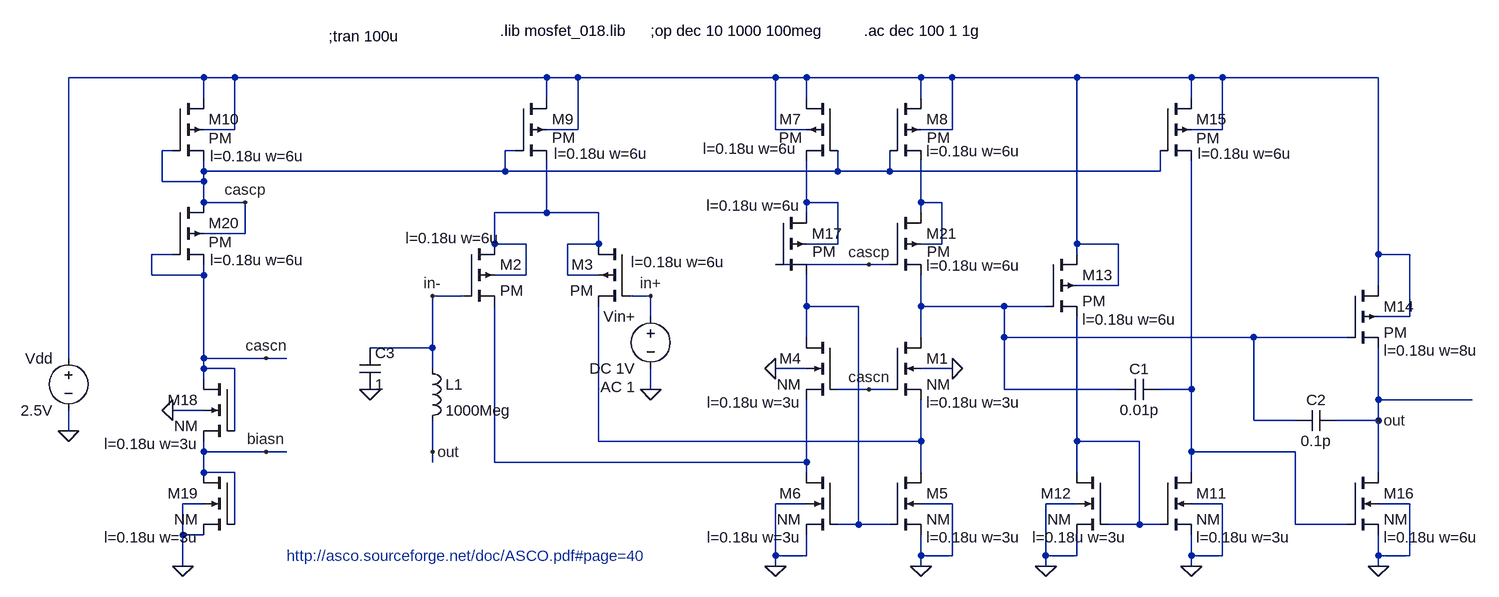
[diagram p0: schematic opamp.asc]
opamp.asc, the LTspice schematic file:
Version 4
SHEET 1 1160 760
WIRE -848 -112 -1056 -112
WIRE -800 -112 -848 -112
WIRE -320 -112 -800 -112
WIRE -272 -112 -320 -112
WIRE 32 -112 -272 -112
WIRE 80 -112 32 -112
WIRE 256 -112 80 -112
WIRE 304 -112 256 -112
WIRE 496 -112 304 -112
WIRE 672 -112 496 -112
WIRE 720 -112 672 -112
WIRE 960 -112 720 -112
WIRE -848 -80 -848 -112
WIRE -320 -80 -320 -112
WIRE 80 -80 80 -112
WIRE 256 -80 256 -112
WIRE 672 -80 672 -112
WIRE -800 -32 -800 -112
WIRE -800 -32 -848 -32
WIRE -272 -32 -272 -112
WIRE -272 -32 -320 -32
WIRE 32 -32 32 -112
WIRE 80 -32 32 -32
WIRE 304 -32 304 -112
WIRE 304 -32 256 -32
WIRE 720 -32 720 -112
WIRE 720 -32 672 -32
WIRE -896 0 -912 0
WIRE -368 0 -384 0
WIRE -848 32 -848 16
WIRE -384 32 -384 0
WIRE -384 32 -848 32
WIRE 128 32 128 0
WIRE 128 32 -384 32
WIRE 208 32 208 0
WIRE 208 32 128 32
WIRE 624 32 624 0
WIRE 624 32 208 32
WIRE -912 48 -912 0
WIRE -848 48 -848 32
WIRE -848 48 -912 48
WIRE -848 80 -848 48
WIRE -784 80 -848 80
WIRE 80 80 80 16
WIRE 128 80 80 80
WIRE 256 80 256 16
WIRE 288 80 256 80
WIRE -320 96 -320 16
WIRE -320 96 -400 96
WIRE -240 96 -320 96
WIRE 80 96 80 80
WIRE 256 96 256 80
WIRE -784 128 -784 80
WIRE -784 128 -848 128
WIRE -400 144 -400 96
WIRE -352 144 -400 144
WIRE -240 144 -240 96
WIRE -240 144 -288 144
WIRE 128 144 128 80
WIRE 128 144 80 144
WIRE 288 144 288 80
WIRE 288 144 256 144
WIRE 496 144 496 -112
WIRE 560 144 496 144
WIRE -896 160 -928 160
WIRE 496 160 496 144
WIRE 960 160 960 -112
WIRE 1008 160 960 160
WIRE 176 176 32 176
WIRE 208 176 176 176
WIRE -928 192 -928 160
WIRE -848 192 -848 176
WIRE -848 192 -928 192
WIRE -352 192 -352 144
WIRE -352 192 -400 192
WIRE -288 192 -288 144
WIRE -240 192 -288 192
WIRE 560 208 560 144
WIRE 560 208 496 208
WIRE 960 208 960 160
WIRE -448 224 -496 224
WIRE -160 224 -192 224
WIRE 80 240 80 192
WIRE 160 240 80 240
WIRE 256 240 256 192
WIRE 384 240 256 240
WIRE 448 240 384 240
WIRE -160 256 -160 224
WIRE 1008 256 1008 160
WIRE 1008 256 960 256
WIRE 80 288 80 240
WIRE 256 288 256 240
WIRE 384 288 384 240
WIRE 768 288 384 288
WIRE 912 288 768 288
WIRE -496 304 -496 224
WIRE -496 304 -592 304
WIRE -1056 320 -1056 -112
WIRE -848 320 -848 192
WIRE -752 320 -848 320
WIRE -720 320 -752 320
WIRE -848 336 -848 320
WIRE -800 336 -848 336
WIRE -496 336 -496 304
WIRE 80 336 32 336
WIRE 304 336 256 336
WIRE -848 352 -848 336
WIRE -160 368 -160 336
WIRE 176 368 128 368
WIRE 208 368 176 368
WIRE 384 368 384 288
WIRE 560 368 384 368
WIRE 672 368 672 16
WIRE 672 368 624 368
WIRE 960 384 960 304
WIRE 1104 384 960 384
WIRE -848 400 -896 400
WIRE 768 416 768 288
WIRE 832 416 768 416
WIRE 960 416 960 384
WIRE 960 416 896 416
WIRE -1056 432 -1056 400
WIRE -800 432 -800 336
WIRE -240 448 -240 240
WIRE 256 448 256 384
WIRE 256 448 -240 448
WIRE 496 448 496 256
WIRE 592 448 496 448
WIRE -848 464 -848 448
WIRE -752 464 -848 464
WIRE -720 464 -752 464
WIRE -496 464 -496 416
WIRE 672 464 672 368
WIRE 832 464 672 464
WIRE -496 480 -496 464
WIRE -400 480 -400 240
WIRE 80 480 80 384
WIRE 80 480 -400 480
WIRE -848 496 -848 464
WIRE -800 496 -848 496
WIRE 80 496 80 480
WIRE 256 496 256 448
WIRE 496 496 496 448
WIRE 672 496 672 464
WIRE 960 496 960 416
WIRE -848 512 -848 496
WIRE -848 544 -880 544
WIRE 80 544 32 544
WIRE 304 544 256 544
WIRE 496 544 448 544
WIRE 720 544 672 544
WIRE 1008 544 960 544
WIRE -800 576 -800 496
WIRE 160 576 160 240
WIRE 160 576 128 576
WIRE 208 576 160 576
WIRE 592 576 592 448
WIRE 592 576 544 576
WIRE 624 576 592 576
WIRE 832 576 832 464
WIRE 912 576 832 576
WIRE -880 592 -880 544
WIRE -848 592 -880 592
WIRE 32 624 32 544
WIRE 80 624 80 592
WIRE 80 624 32 624
WIRE 256 624 256 592
WIRE 304 624 304 544
WIRE 304 624 256 624
WIRE 448 624 448 544
WIRE 496 624 496 592
WIRE 496 624 448 624
WIRE 672 624 672 592
WIRE 720 624 720 544
WIRE 720 624 672 624
WIRE 960 624 960 592
WIRE 1008 624 1008 544
WIRE 1008 624 960 624
WIRE -880 640 -880 592
WIRE 32 640 32 624
WIRE 256 640 256 624
WIRE 448 640 448 624
WIRE 672 640 672 624
WIRE 960 640 960 624
FLAG 32 336 0
FLAG 304 336 0
FLAG 32 640 0
FLAG 256 640 0
FLAG -160 368 0
FLAG -1056 432 0
FLAG 448 640 0
FLAG 672 640 0
FLAG 960 640 0
FLAG -880 640 0
FLAG -160 224 in+
FLAG -496 224 in-
FLAG 960 416 out
FLAG -896 400 0
FLAG -592 368 0
FLAG -752 464 biasn
FLAG -752 320 cascn
FLAG -784 80 cascp
FLAG 176 368 cascn
FLAG 176 176 cascp
FLAG -496 464 out
DATAFLAG 1056 384 ""
DATAFLAG 736 288 ""
SYMBOL nmos4 208 288 R0
WINDOW 123 56 100 Left 2
SYMATTR Value2 l=0.18u w=3u
SYMATTR InstName M1
SYMATTR Value NM
SYMBOL pmos4 -448 144 R0
WINDOW 123 -89 -9 Left 2
SYMATTR Value2 l=0.18u w=6u
SYMATTR InstName M2
SYMATTR Value PM
SYMBOL pmos4 -192 144 M0
WINDOW 123 -147 28 Left 2
SYMATTR Value2 l=0.18u w=6u
SYMATTR InstName M3
SYMATTR Value PM
SYMBOL nmos4 128 288 M0
WINDOW 123 56 100 Left 2
SYMATTR Value2 l=0.18u w=3u
SYMATTR InstName M4
SYMATTR Value NM
SYMBOL nmos4 208 496 R0
WINDOW 123 56 100 Left 2
SYMATTR Value2 l=0.18u w=3u
SYMATTR InstName M5
SYMATTR Value NM
SYMBOL nmos4 128 496 M0
WINDOW 123 56 100 Left 2
SYMATTR Value2 l=0.18u w=3u
SYMATTR InstName M6
SYMATTR Value NM
SYMBOL pmos4 128 -80 M0
WINDOW 3 55 60 Left 2
WINDOW 123 62 77 Left 2
SYMATTR Value PM
SYMATTR Value2 l=0.18u w=6u
SYMATTR InstName M7
SYMBOL pmos4 208 -80 R0
WINDOW 3 57 60 Left 2
WINDOW 123 56 81 Left 2
SYMATTR Value PM
SYMATTR Value2 l=0.18u w=6u
SYMATTR InstName M8
SYMBOL pmos4 -368 -80 R0
WINDOW 3 56 60 Left 2
WINDOW 123 59 85 Left 2
SYMATTR Value PM
SYMATTR Value2 l=0.18u w=6u
SYMATTR InstName M9
SYMBOL pmos4 -896 -80 R0
WINDOW 3 56 61 Left 2
WINDOW 123 58 89 Left 2
SYMATTR Value PM
SYMATTR Value2 l=0.18u w=6u
SYMATTR InstName M10
SYMBOL voltage -160 240 M0
WINDOW 123 24 124 Left 2
WINDOW 39 0 0 Left 2
SYMATTR Value2 AC 1
SYMATTR InstName Vin+
SYMATTR Value DC 1V
SYMBOL voltage -1056 304 M0
SYMATTR InstName Vdd
SYMATTR Value 2.5V
SYMBOL nmos4 624 496 R0
WINDOW 123 56 100 Left 2
SYMATTR Value2 l=0.18u w=3u
SYMATTR InstName M11
SYMATTR Value NM
SYMBOL nmos4 544 496 M0
WINDOW 123 -29 100 Left 2
SYMATTR Value2 l=0.18u w=3u
SYMATTR InstName M12
SYMATTR Value NM
SYMBOL pmos4 448 160 R0
WINDOW 123 56 100 Left 2
SYMATTR Value2 l=0.18u w=6u
SYMATTR InstName M13
SYMATTR Value PM
SYMBOL cap 624 352 R90
WINDOW 0 0 32 VBottom 2
WINDOW 3 32 32 VTop 2
SYMATTR InstName C1
SYMATTR Value 0.01p
SYMBOL pmos4 912 208 R0
WINDOW 123 56 100 Left 2
SYMATTR Value2 l=0.18u w=8u
SYMATTR InstName M14
SYMATTR Value PM
SYMBOL cap 896 400 R90
WINDOW 0 0 32 VBottom 2
WINDOW 3 32 32 VTop 2
SYMATTR InstName C2
SYMATTR Value 0.1p
SYMBOL pmos4 624 -80 R0
WINDOW 3 56 61 Left 2
WINDOW 123 58 85 Left 2
SYMATTR Value PM
SYMATTR Value2 l=0.18u w=6u
SYMATTR InstName M15
SYMBOL nmos4 912 496 R0
WINDOW 123 56 100 Left 2
SYMATTR Value2 l=0.18u w=6u
SYMATTR InstName M16
SYMATTR Value NM
SYMBOL nmos4 -800 352 M0
WINDOW 123 56 100 Left 2
SYMATTR Value2 l=0.18u w=3u
SYMATTR InstName M18
SYMATTR Value NM
SYMBOL nmos4 -800 496 M0
WINDOW 123 56 100 Left 2
SYMATTR Value2 l=0.18u w=3u
SYMATTR InstName M19
SYMATTR Value NM
SYMBOL ind -512 320 R0
SYMATTR InstName L1
SYMATTR Value 1000Meg
SYMBOL cap -608 304 R0
SYMATTR InstName C3
SYMATTR Value 1
SYMBOL pmos4 -896 80 R0
WINDOW 3 56 61 Left 2
WINDOW 123 58 89 Left 2
SYMATTR Value PM
SYMATTR Value2 l=0.18u w=6u
SYMATTR InstName M20
SYMBOL pmos4 32 96 R0
WINDOW 3 57 60 Left 2
WINDOW 123 -106 -11 Left 2
SYMATTR Value PM
SYMATTR Value2 l=0.18u w=6u
SYMATTR InstName M17
SYMBOL pmos4 208 96 R0
WINDOW 3 57 60 Left 2
WINDOW 123 56 81 Left 2
SYMATTR Value PM
SYMATTR Value2 l=0.18u w=6u
SYMATTR InstName M21
TEXT -656 -176 Left 2 !;tran 100u
TEXT -720 624 Left 2 ;http://asco.sourceforge.net/doc/ASCO.pdf#page=40
TEXT -392 -184 Left 2 !.lib mosfet_018.lib
TEXT -160 -184 Left 2 !;op dec 10 1000 100meg
TEXT 168 -184 Left 2 !.ac dec 100 1 1g

The netlist it stands for:
* opamp.asc
M1 N006 cascn N008 0 NM l=0.18u w=3u
M2 N004 in- N010 N004 PM l=0.18u w=6u
M3 N004 in+ N008 N004 PM l=0.18u w=6u
M4 N005 cascn N010 0 NM l=0.18u w=3u
M5 N008 N005 0 0 NM l=0.18u w=3u
M6 N010 N005 0 0 NM l=0.18u w=3u
M7 N001 cascp N002 N001 PM l=0.18u w=6u
M8 N001 cascp N003 N001 PM l=0.18u w=6u
M9 N001 cascp N004 N001 PM l=0.18u w=6u
M10 N001 cascp cascp N001 PM l=0.18u w=6u
Vin+ in+ 0 DC 1V AC 1
Vdd N001 0 2.5V
M11 N007 N009 0 0 NM l=0.18u w=3u
M12 N009 N009 0 0 NM l=0.18u w=3u
M13 N001 N006 N009 N001 PM l=0.18u w=6u
C1 N007 N006 0.01p
M14 N001 N006 out N001 PM l=0.18u w=8u
C2 out N006 0.1p
M15 N001 cascp N007 N001 PM l=0.18u w=6u
M16 out N007 0 0 NM l=0.18u w=6u
M18 cascn cascn biasn 0 NM l=0.18u w=3u
M19 biasn biasn 0 0 NM l=0.18u w=3u
L1 in- out 1000Meg
C3 in- 0 1
M20 cascp cascn cascn cascp PM l=0.18u w=6u
M17 N002 cascp N005 N002 PM l=0.18u w=6u
M21 N003 cascp N006 N003 PM l=0.18u w=6u
.model NMOS NMOS
.model PMOS PMOS
.lib standard.mos
;tran 100u
* http://asco.sourceforge.net/doc/ASCO.pdf#page=40
.lib mosfet_018.lib
;op dec 10 1000 100meg
.ac dec 100 1 1g
.backanno
.end